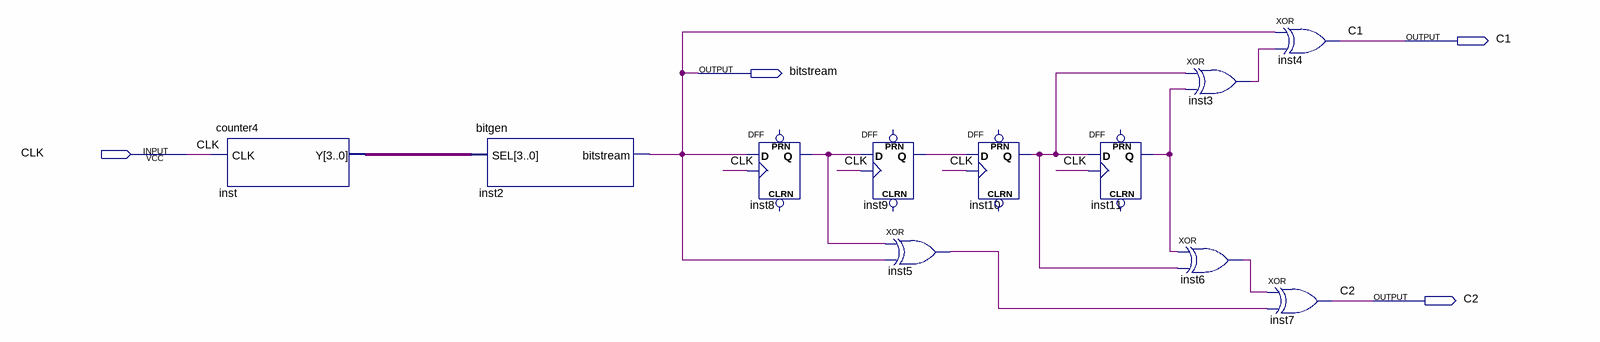
[diagram p0: schematic sheet]
// Quartus schematic lab_two.bdf as structural Verilog: 11 symbols, 4 pins
module lab_two (
  input  CLK,
  output C1,
  output bitstream,
  output C2
);

  wire inst3_out, inst5_out, inst6_out, inst8_q, inst9_q, inst10_q, inst11_q;
  wire [3:0] inst_y;

  counter4 inst (.CLK(CLK), .Y(inst_y));
  bitgen inst2 (.SEL(inst_y), .bitstream(bitstream));
  DFF inst8 (.CLK(CLK), .D(bitstream), .Q(inst8_q));  // open: CLRN, PRN
  DFF inst9 (.CLK(CLK), .D(inst8_q), .Q(inst9_q));  // open: CLRN, PRN
  xor inst5 (inst5_out, inst8_q, bitstream);
  DFF inst10 (.CLK(CLK), .D(inst9_q), .Q(inst10_q));  // open: CLRN, PRN
  DFF inst11 (.CLK(CLK), .D(inst10_q), .Q(inst11_q));  // open: CLRN, PRN
  xor inst3 (inst3_out, inst10_q, inst11_q);
  xor inst6 (inst6_out, inst11_q, inst10_q);
  xor inst4 (C1, bitstream, inst3_out);
  xor inst7 (C2, inst6_out, inst5_out);
endmodule
